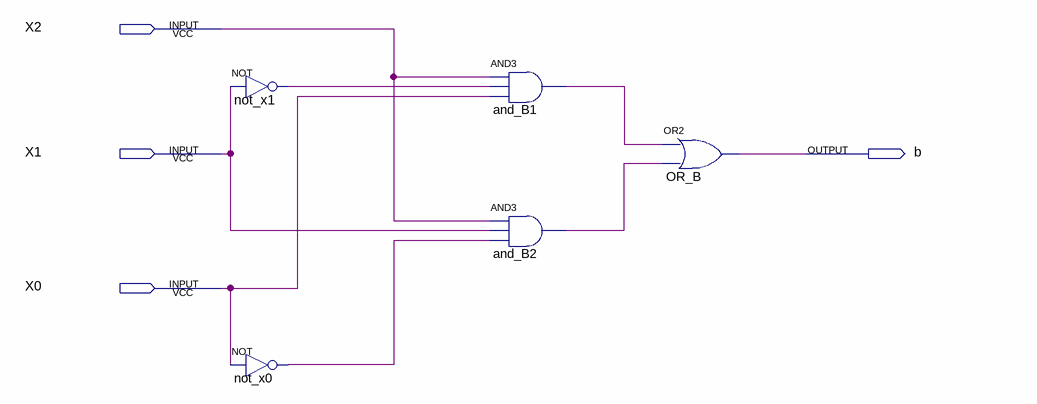
[diagram p0: schematic sheet]
// Quartus schematic dec_segmento_B.bdf as structural Verilog: 5 symbols, 4 pins
module dec_segmento_B (
  input  X2,
  input  X1,
  input  X0,
  output b
);

  wire and_B1_out, and_B2_out, not_x0_out, not_x1_out;

  not not_x1 (not_x1_out, X1);
  not not_x0 (not_x0_out, X0);
  and and_B1 (and_B1_out, X2, not_x1_out, X0);
  and and_B2 (and_B2_out, X2, X1, not_x0_out);
  or OR_B (b, and_B1_out, and_B2_out);
endmodule
